# Altium schematic sheet gpio.SchDoc
size A4
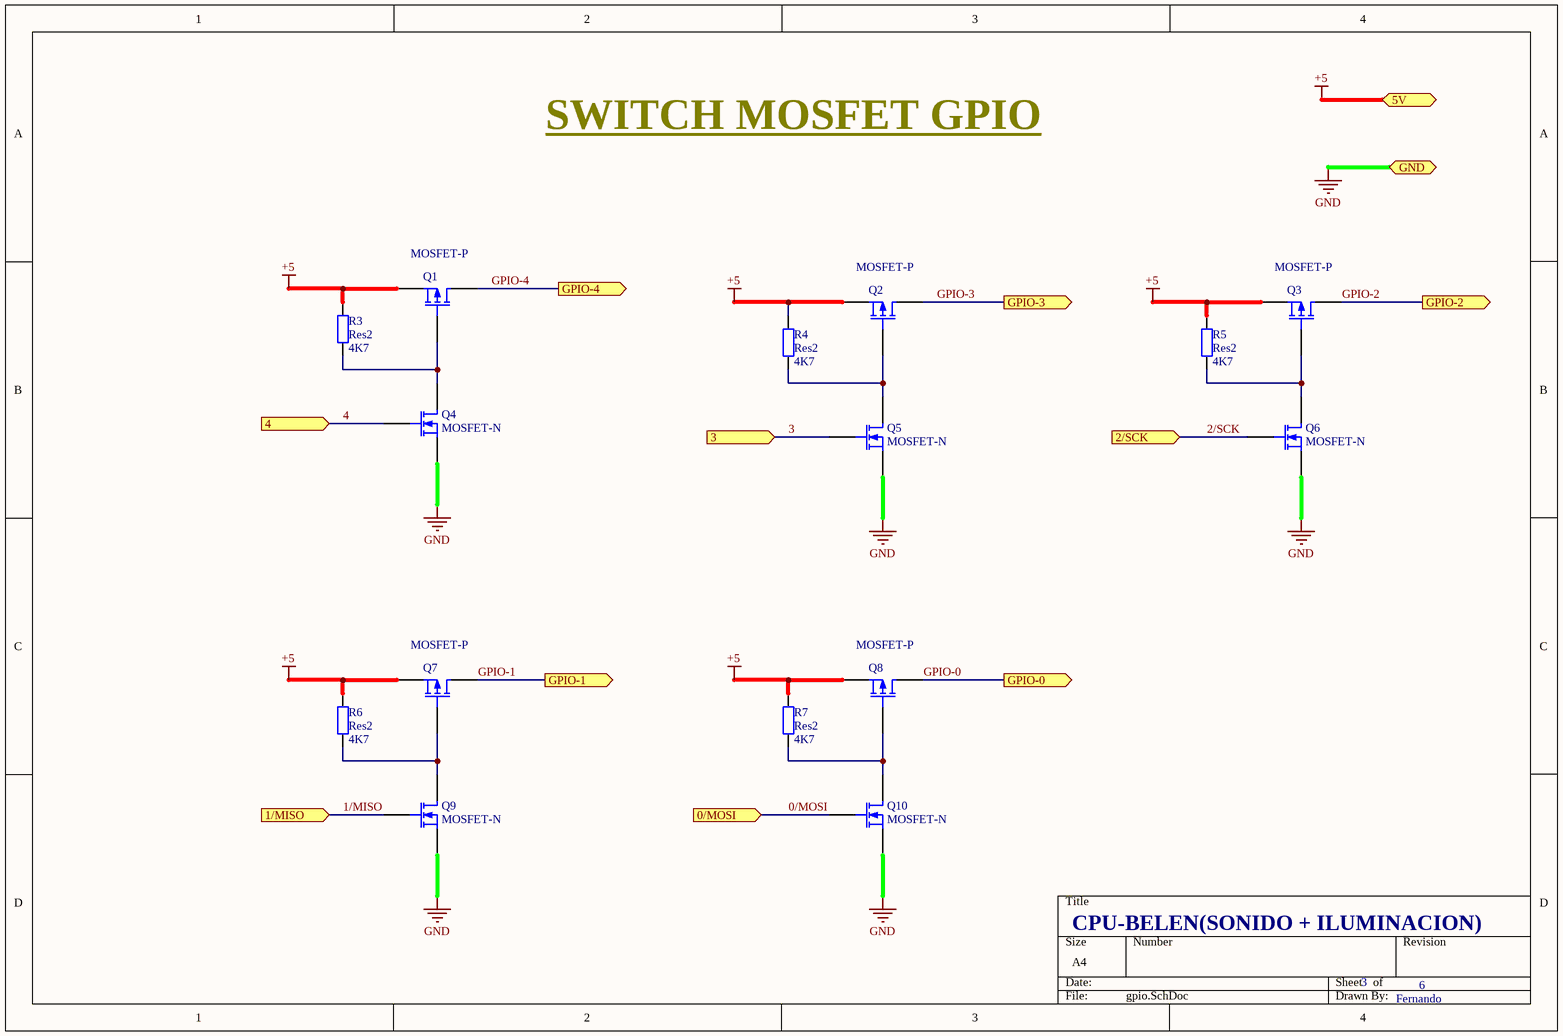
[diagram p0: gpio.SchDoc]

## Parts
Q1  MOSFET-P  [E3]
Q2  MOSFET-P  [E3]
Q3  MOSFET-P  [E3]
Q4  MOSFET-N  [E3]
Q5  MOSFET-N  [E3]
Q6  MOSFET-N  [E3]
Q7  MOSFET-P  [E3]
Q8  MOSFET-P  [E3]
Q9  MOSFET-N  [E3]
Q10  MOSFET-N  [E3]
R3  Res2  value 4K7  [AXIAL-0.4]
R4  Res2  value 4K7  [AXIAL-0.4]
R5  Res2  value 4K7  [AXIAL-0.4]
R6  Res2  value 4K7  [AXIAL-0.4]
R7  Res2  value 4K7  [AXIAL-0.4]

## Ports
0/MOSI (in), 1/MISO (in), 2/SCK (in), 3 (in), 4 (in), 5V (bidir), GND (bidir), GPIO-0 (out), GPIO-1 (out), GPIO-2 (out), GPIO-3 (out), GPIO-4 (out)

## Nets
+5: Q1.3(S) Q2.3(S) Q3.3(S) Q7.3(S) Q8.3(S) R3.2 R4.2 R5.2 R6.2 R7.2 ; port 5V
GND: Q4.3(S) Q5.3(S) Q6.3(S) Q9.3(S) Q10.3(S) ; port GND
0/MOSI: Q10.2(G) ; port 0/MOSI
1/MISO: Q9.2(G) ; port 1/MISO
2/SCK: Q6.2(G) ; port 2/SCK
3: Q5.2(G) ; port 3
4: Q4.2(G) ; port 4
GPIO-0: Q8.1(D) ; port GPIO-0
GPIO-1: Q7.1(D) ; port GPIO-1
GPIO-2: Q3.1(D) ; port GPIO-2
GPIO-3: Q2.1(D) ; port GPIO-3
GPIO-4: Q1.1(D) ; port GPIO-4
NetQ1_2: Q1.2(G) Q4.1(D) R3.1
NetQ2_2: Q2.2(G) Q5.1(D) R4.1
NetQ3_2: Q3.2(G) Q6.1(D) R5.1
NetQ7_2: Q7.2(G) Q9.1(D) R6.1
NetQ8_2: Q8.2(G) Q10.1(D) R7.1

## Notes on the sheet
- SWITCH MOSFET GPIO
- CPU-BELEN(SONIDO + ILUMINACION)
- 3
- Fernando
- 6

## Library data of the parts
Q1-Q3 Q7 Q8 = MOSFET-P: P-Channel MOSFET; Published: 8-Jun-2000; LatestRevisionDate: 17-Jul-2002; LatestRevisionNote: Re-released for DXP Platform.; PackageVersion: 1995/1996; PackageReference: E3; Publisher: Altium Limited; PackageDescription: TO, Flat Index; 3 In-Line, Axial Leads; Body Dia. 4.6mm; Lead Dia. 0.5 mm (max)
Q4-Q6 Q9 Q10 = MOSFET-N: N-Channel MOSFET; Published: 8-Jun-2000; LatestRevisionDate: 17-Jul-2002; LatestRevisionNote: Re-released for DXP Platform.; PackageVersion: 1995/1996; PackageReference: E3; Publisher: Altium Limited; PackageDescription: TO, Flat Index; 3 In-Line, Axial Leads; Body Dia. 4.6mm; Lead Dia. 0.5 mm (max)
R3-R7 = Res2: Resistor; Published: 8-Jun-2000; LatestRevisionDate: 17-Jul-2002; LatestRevisionNote: Re-released for DXP Platform.; PackageReference: AXIAL-0.4; Publisher: Altium Limited; PackageDescription: Axial Device, Thru-Hole; 2 Leads; 0.4 in Pin Spacing